# EAGLE design solar-earrings (EAGLE 7.5.0)
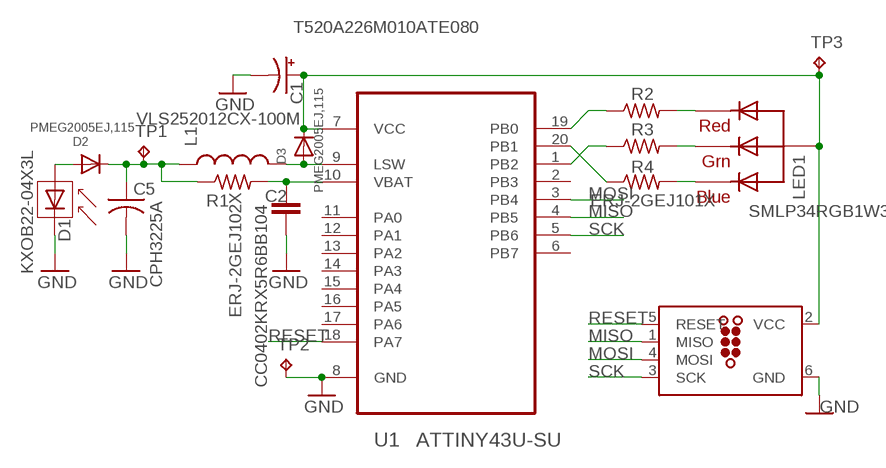
[diagram p0: schematic, sheet 1]

## Parts
C1  T520A226M010ATE080  CAP_POL1206  [EIA3216]
C2  CC0402KRX5R6BB104  CAP0402-CAP  [0402-CAP]
C5  CPH3225A  C-USC3225  [C3225]
D1  KXOB22-04X3L  SOLAR-IXYS-  [SOLARBIT-12X1]
D2  PMEG2005EJ,115  DIODESOD-323F  [SOD-323F]
D3  PMEG2005EJ,115  DIODESOD-323F  [SOD-323F]
J1  TC2030-MCP-NL  [TC2030-MCP-NL]
L1  VLS252012CX-100M  INDUCTOR1007  [1007]
LED1  SMLP34RGB1W3  RGBLED_CA  [RGB1010]
R1  ERJ-2GEJ102X  R-US_R0402  [R0402]
R2  ERJ-2GEJ101X  R-US_R0402  [R0402]
R3  ERJ-2GEJ101X  R-US_R0402  [R0402]
R4  ERJ-2GEJ101X  R-US_R0402  [R0402]
TP1  TPTP06R  [TP06R]
TP2  TPTP06R  [TP06R]
TP3  TPTP06R  [TP06R]
U1  ATTINY43U-SU  [QFN50P400X400X80-21N]

## Nets
GND: C1.C(-) C2.2 C5.2 D1.-(C) J1.6(GND) TP2.TP U1.8(GND)
MISO: J1.1(MISO) U1.4(PB5)
MOSI: J1.4(MOSI) U1.3(PB4)
N$1: LED1.3(BLUE) R4.2
N$2: LED1.4(GREEN) R3.2
N$3: LED1.2(RED) R2.2
N$4: C1.A(+) D3.C J1.2(VCC) LED1.1(VCC) TP3.TP U1.7(VCC)
N$5: R2.1 U1.19(PB0)
N$6: R3.1 U1.1(PB2)
N$7: C5.1 D2.C L1.1 R1.1 TP1.TP
N$8: R4.1 U1.20(PB1)
N$9: D3.A L1.2 U1.9(LSW)
N$26: C2.1 R1.2 U1.10(VBAT)
N$27: D1.+(A) D2.A
RESET: J1.5(RESET) U1.18(PA7)
SCK: J1.3(SCK) U1.5(PB6)
Unconnected: U1.2(PB3) U1.6(PB7) U1.11(PA0) U1.12(PA1) U1.13(PA2) U1.14(PA3) U1.15(PA4) U1.16(PA5) U1.17(PA6)

## Notes on the sheet
- SMLP34RGB1W3

## Library data of the parts
C1 = SparkFun-Passives:CAP_POL: Capacitor Polarized These are standard SMD and PTH capacitors. Normally 10uF, 47uF, and 100uF in electrolytic and tantalum varieties. Always verify the external diameter of the through hole cap, it varies with capacity, voltage, and manufacturer. The EIA devices should be standard.
C2 = SparkFun-Capacitors:CAP: Capacitor Standard 0603 ceramic capacitor, and 0.1" leaded capacitor.
C5 = adafruit:C-US: CAPACITOR, American symbol
D1 = SparkFun-Sensors:SOLAR-IXYS
D2 D3 = adafruit:DIODE: Diode SMADIODE - SMA Surface Mount Package 20V 1A Schottky Diode Digikey: 641-1014-6-ND DO-1N4148 - Through Hole Small Current Diode SOD-123 20V 1 A (.5mV Vf) Schottky Diode - Digikey: MBRX120TPMSCT-ND SOD-323 10V 570mA (.38mV Vf, 3ns) Schottky Diode - Digikey: ZLLS410CT-ND SOD-523 30V 30mA Schottky Diode (RB751S-40TE61) - Digikey: RB751S-40TE61CT-ND SOT23-R/W - SOT23 Package (R = Solder Paste/Reflow Ovens, W = Hand-Soldering) BAT54Film 40V 300mA - Digikey: 497-7162-1-ND
J1 = sonik:TC2030: TAG-CONNECT ICSP Connector Manufacturer: Tag-Connect <http://www.tag-connect.com> Cable for easy In-Circuit Serial Programming. Designed for Microchip ICD2, suitable for many others. Two variants - one "with legs" (for hands-free fit on PCB) and another "without legs" for quick programming. PAD Description 1 MCLR/Vpp 2 Vdd 3 GND 4 PGD (ISPDAT) 5 PGC (ISPCLK) 6 nc (used for LVP) ©2009 ROFA.cz - modified and updated by Robert Darlington ‹rdarlington@gmail.com›
L1 = SparkFun-Passives:INDUCTOR: Inductors Basic Inductor/Choke - 0603 and 1206. Footprints are not proven and vary greatly between part numbers. INDUCTOR POWER 3.3UH 4.0A SMD 0.197" L x 0.197" W x 0.177" H (5.00mm x 5.00mm x 4.50mm)
LED1 = adafruit:RGBLED_CA: RGB LED, common-anode 5MM Staggered pins 5mm Piranha package http://www.ladyada.net/library/pcb/eaglelibrary.html
R1-R4 = adafruit:R-US_: RESISTOR, American symbol
TP1-TP3 = testpad:TP: Test pad
U1 = element14Atmel:ATTINY43U-SU: 8-bit Microcontroller with In-System Programmable Flash and Boost Converter

## Board
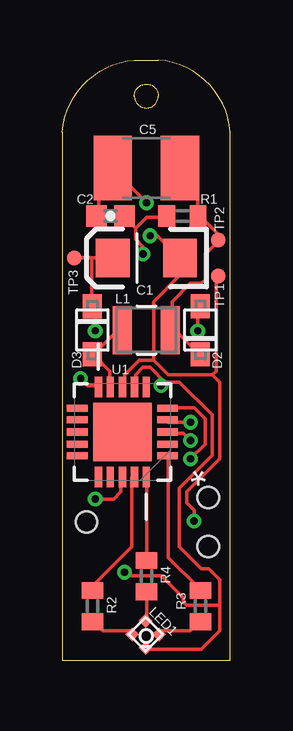
[diagram p1: board, top side]
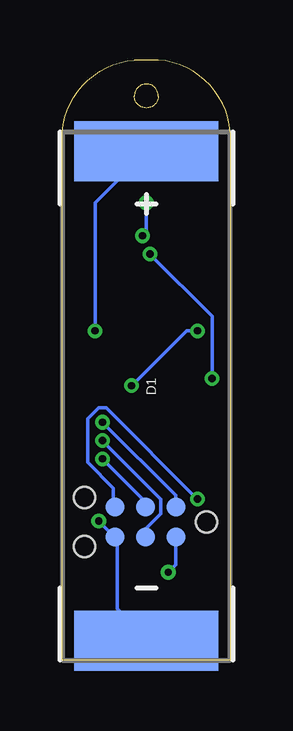
[diagram p2: board, bottom side, seen from below]

Size 7 x 25 mm. Coordinates in mm from the lower left corner, seen from the top.
Outline: 0,0 7,0 7,22 arc81 4,25 3,25 arc81 0,22 0,0
Outline: 3,23.5 arc180 4,23.5 arc180 3,23.5
Copper layers (1*16): Top 0.035mm / dielectric 1.5mm / Bottom 0.035mm
Design rules "MF_Standard_2_Layer": minimum track width 6mil, minimum drill 12mil, track to track 6mil, track to pad 6mil, pad to pad 6mil, via to via 6mil, smd to smd 0mil, copper to edge 10mil, drill to drill 10mil, minimum pad ring 6mil, minimum via ring 6mil, stop-mask expansion 2mil, vias tented up to drill 25mil, thermal gap 10mil

### Footprints (pad centres in the part's own frame; a part is rotated, then mirrored left to right if it is on the bottom)
EIA3216 = smd 1.4 x 1.6: A 1.4,0; C -1.4,0
0402-CAP = smd 0.85 x 0.9: 1 -0.58,0; 2 0.58,0
C3225 = smd 1.6 x 2.7: 1 -1.4,0; 2 1.4,0
SOLARBIT-12X1 = smd 2.5 x 6: + -10.2,0; - 10.2,0
SOD-323F = smd 1 x 0.8: A -1,0; C 1,0
TC2030-MCP-NL = smd 0.787 x 0.787: 1 1.27,-0.635; 2 1.27,0.635; 3 2.54,-0.635; 4 2.54,0.635; 5 3.81,-0.635; 6 3.81,0.635 | hole 0.889: 0,0; 5.08,-1.016; 5.08,1.016
1007 = smd 2 x 0.8: 1 0,1; 2 0,-1
RGB1010 = smd 0.4 x 0.4: 1 0.373,0.327; 2 0.373,-0.473; 3 -0.427,-0.473; 4 -0.427,0.327
R0402 = smd 0.7 x 0.9: 1 -0.65,0; 2 0.65,0
TP06R = smd 0.6 x 0.6: TP 0,0
QFN50P400X400X80-21N = smd 0.864 x 0.305: 1 -1.88,0.991; 2 -1.88,0.508; 3 -1.88,0; 4 -1.88,-0.508; 5 -1.88,-0.991; 11 1.88,-0.991; 12 1.88,-0.508; 13 1.88,0; 14 1.88,0.508; 15 1.88,0.991 | smd 0.305 x 0.864: 6 -0.991,-1.88; 7 -0.508,-1.88; 8 0,-1.88; 9 0.508,-1.88; 10 0.991,-1.88; 16 0.991,1.88; 17 0.508,1.88; 18 0,1.88; 19 -0.508,1.88; 20 -0.991,1.88 | smd 2.438 x 2.438: 21 0,0

### Placement (x,y rotation side)
C1  3.5,16.75 180 top
C2  2,18.5 180 top
C5  3.5,20.5 180 top
D1  3.5,11 270 bottom
D2  5.75,13.75 270 top
D3  1.25,13.75 90 top
J1  1,5.75 180 bottom
L1  3.5,13.75 270 top
LED1  3.5,1 225 top
R1  5,18.5 180 top
R2  1.25,2.25 270 top
R3  5.75,2.25 270 top
R4  3.5,3.5 270 top
TP1  6.5,17.5 0 top
TP2  6.5,16 0 top
TP3  0.5,16.75 0 top
U1  2.5,9.5 180 top

### Tracks (layer width: path | path; a pad name or v marks a point on that pad's centre or on a via)
GND  (via drill 0.3)
  Top 0.152: C2.2 1.52,18.59 1.52,19.96 1.98,20.42 C5.2 2.13,20.42 v3.5,19.05 | 6.25,11.89 6.4,12.04 6.4,15.85 TP2.TP | 6.25,11.89 4.42,11.89 3.81,12.5 | 3.81,12.5 3.2,12.5 2.59,11.89 2.59,11.43 U1.8 | 3.81,12.5 3.81,14.94 4.88,16 4.88,16.61 C1.C 4.88,16.76 3.96,17.68 v3.66,17.68 | v5.49,5.79 5.49,6.25 5.18,6.55 5.18,7.01 6.55,8.38 6.55,11.58 6.25,11.89
  Bottom 0.152: D1.- 3.5,0.91 4.72,2.13 4.72,5.03 J1.6 4.88,5.18 v5.49,5.79 | v3.5,19.05 3.5,17.83 v3.66,17.68
MISO  (via drill 0.3)
  Top 0.152: v5.33,9.91 4.42,9.91 U1.4
  Bottom 0.152: v5.33,9.91 2.29,6.86 2.29,6.4 J1.1
MOSI  (via drill 0.3)
  Top 0.152: v5.33,9.14 5.03,9.45 4.42,9.45 U1.3
  Bottom 0.152: v5.33,9.14 2.9,6.71 2.9,6.1 3.5,5.49 3.5,5.18 J1.4
N$1
  Top 0.152: LED1.3 3.5,1.68 3.5,2.74 R4.2
N$2
  Top 0.152: LED1.4 4.12,1.22 5.33,1.22 5.64,1.52 R3.2
N$3
  Top 0.152: LED1.2 2.9,1.22 1.68,1.22 1.37,1.52 R2.2
N$4  (via drill 0.3)
  Top 0.152: 1.22,16.76 1.98,16.76 C1.A | 1.22,16.76 0.61,16.76 TP3.TP | 1.22,16.76 1.22,14.78 D3.C 1.37,14.63 v1.37,13.72 | 6.55,2.29 6.55,3.35 6.1,3.81 5.79,3.81 4.88,4.72 4.88,7.16 6.25,8.53 6.25,10.21 4.88,11.58 4.27,11.58 | 6.55,2.29 6.55,1.22 5.79,0.46 3.5,0.46 LED1.1 | 4.27,11.58 3.66,12.19 3.35,12.19 3.05,11.89 3.05,11.43 U1.7 | v2.59,3.66 2.74,3.66 2.9,3.5 4.12,3.5 5.03,2.59 5.03,2.44 5.18,2.29 6.55,2.29 | 4.27,11.58 v4.12,11.43
  Bottom 0.152: v2.59,3.66 2.29,3.96 2.29,5.03 J1.2 | v1.37,13.72 1.83,13.72 v4.12,11.43
N$5
  Top 0.152: U1.19 2.9,7.62 2.9,4.72 1.22,3.05 R2.1
N$6
  Top 0.152: U1.1 4.42,8.38 4.42,4.27 5.64,3.05 R3.1
N$7
  Top 0.152: 4.57,13.87 5.64,12.8 D2.C | 4.57,13.87 L1.1 4.57,13.87 | C5.1 5.03,20.42 5.64,19.81 5.64,18.59 R1.1 5.79,18.44 6.4,17.83 6.4,17.53 TP1.TP 6.4,17.37 5.94,16.92 5.94,15.85 5.79,15.7 5.33,15.7 4.57,14.94 4.57,13.87
N$8
  Top 0.152: U1.20 3.5,7.62 3.5,4.27 R4.1
N$9
  Top 0.152: U1.9 1.98,11.43 1.98,12.04 1.37,12.65 D3.A 1.37,12.8 2.44,13.87 L1.2
N$26  (via drill 0.3)
  Top 0.152: v0.76,11.73 1.07,11.43 1.37,11.43 U1.10 | v3.35,16.92 3.35,17.22 3.05,17.53 3.05,17.98 | 3.05,17.98 2.59,18.44 C2.1 | 3.05,17.98 3.5,18.44 4.27,18.44 R1.2
  Bottom 0.152: v0.76,11.73 0.76,14.33 v3.35,16.92
N$27  (via drill 0.3)
  Top 0.152: v5.64,13.72 5.64,14.63 D2.A
  Bottom 0.152: v5.64,13.72 5.64,19.05 3.5,21.18 D1.+
RESET  (via drill 0.3)
  Top 0.152: v1.37,6.71 2.13,6.71 2.44,7.01 2.44,7.62 U1.18
  Bottom 0.152: v1.37,6.71 5.18,10.52 5.49,10.52 5.94,10.06 5.94,8.23 4.88,7.16 4.88,6.4 J1.5
SCK  (via drill 0.3)
  Top 0.152: v5.33,8.38 5.94,8.99 5.94,10.06 5.49,10.52 4.42,10.52 U1.5
  Bottom 0.152: v5.33,8.38 3.66,6.71 3.66,6.4 J1.3